# EAGLE design servo (EAGLE 7.5.0)
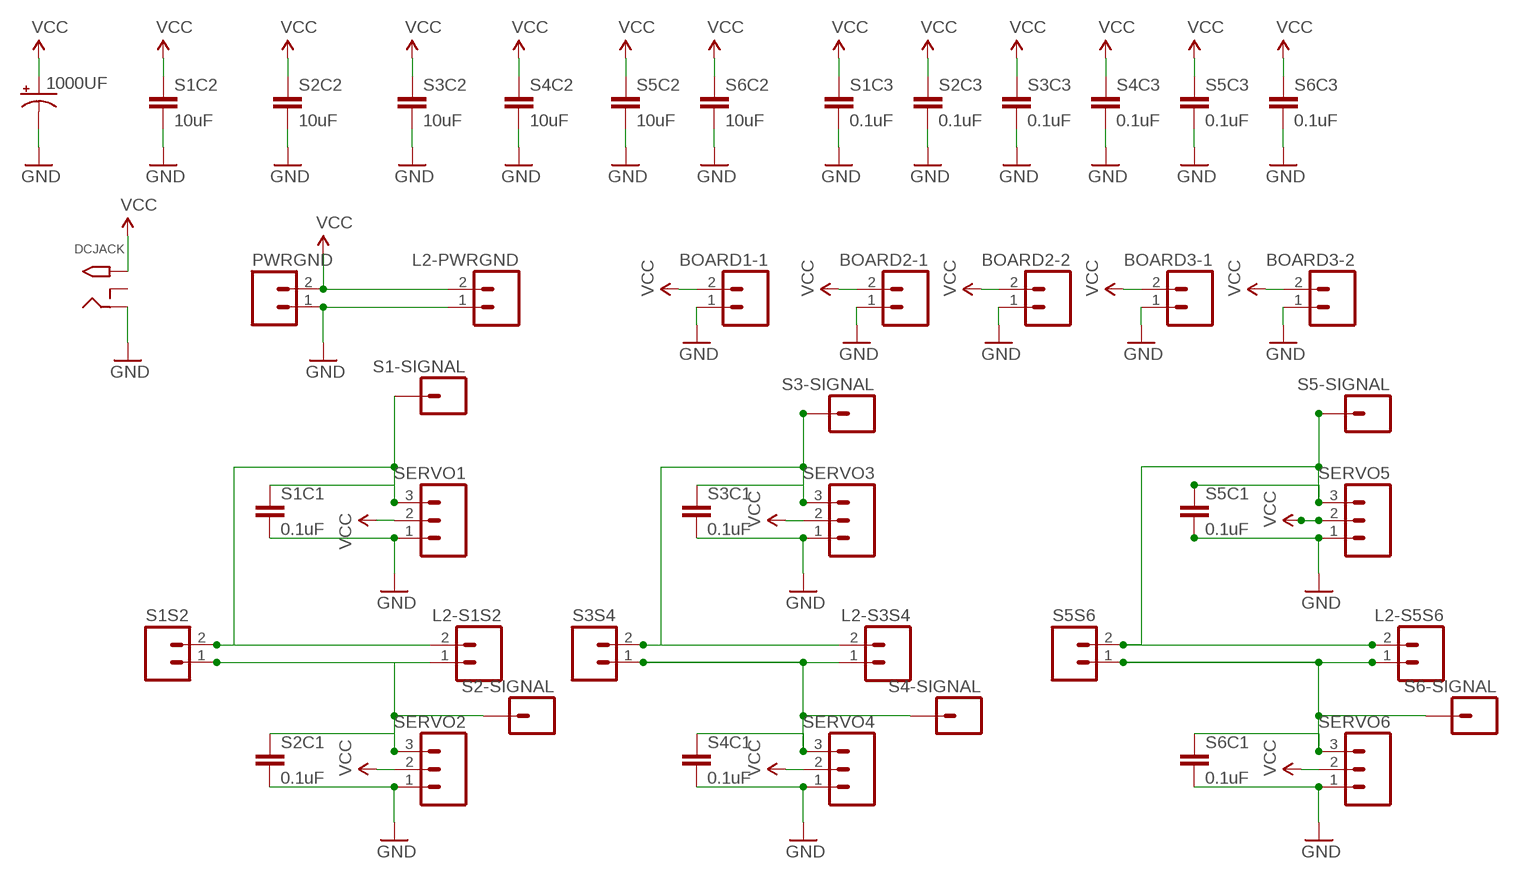
[diagram p0: schematic, sheet 1]

## Parts
1000UF  CAP_POLG  [PANASONIC_G]
BOARD1-1  M02PTH  [1X02]
BOARD2-1  M02PTH  [1X02]
BOARD2-2  M02PTH  [1X02]
BOARD3-1  M02PTH  [1X02]
BOARD3-2  M02PTH  [1X02]
DCJACK  2.1MMJACKTHM  [PJ-102A]
L2-PWRGND  M02PTH  [1X02]
L2-S1S2  M02PTH  [1X02]
L2-S3S4  M02PTH  [1X02]
L2-S5S6  M02PTH  [1X02]
PWRGND  M02PTH  [1X02]
S1-SIGNAL  M01PTH  [1X01]
S1C1  0.1uF  0.1UF-25V-5%(0603)  [0603-CAP]
S1C2  10uF  10UF-6.3V-20%(0603)  [0603-CAP]
S1C3  0.1uF  0.1UF-25V-5%(0603)  [0603-CAP]
S1S2  M02PTH  [1X02]
S2-SIGNAL  M01PTH  [1X01]
S2C1  0.1uF  0.1UF-25V-5%(0603)  [0603-CAP]
S2C2  10uF  10UF-6.3V-20%(0603)  [0603-CAP]
S2C3  0.1uF  0.1UF-25V-5%(0603)  [0603-CAP]
S3-SIGNAL  M01PTH  [1X01]
S3C1  0.1uF  0.1UF-25V-5%(0603)  [0603-CAP]
S3C2  10uF  10UF-6.3V-20%(0603)  [0603-CAP]
S3C3  0.1uF  0.1UF-25V-5%(0603)  [0603-CAP]
S3S4  M02PTH  [1X02]
S4-SIGNAL  M01PTH  [1X01]
S4C1  0.1uF  0.1UF-25V-5%(0603)  [0603-CAP]
S4C2  10uF  10UF-6.3V-20%(0603)  [0603-CAP]
S4C3  0.1uF  0.1UF-25V-5%(0603)  [0603-CAP]
S5-SIGNAL  M01PTH  [1X01]
S5C1  0.1uF  0.1UF-25V-5%(0603)  [0603-CAP]
S5C2  10uF  10UF-6.3V-20%(0603)  [0603-CAP]
S5C3  0.1uF  0.1UF-25V-5%(0603)  [0603-CAP]
S5S6  M02PTH  [1X02]
S6-SIGNAL  M01PTH  [1X01]
S6C1  0.1uF  0.1UF-25V-5%(0603)  [0603-CAP]
S6C2  10uF  10UF-6.3V-20%(0603)  [0603-CAP]
S6C3  0.1uF  0.1UF-25V-5%(0603)  [0603-CAP]
SERVO1  M03PTH  [1X03]
SERVO2  M03PTH  [1X03]
SERVO3  M03PTH  [1X03]
SERVO4  M03PTH  [1X03]
SERVO5  M03PTH  [1X03]
SERVO6  M03PTH  [1X03]

## Nets
GND: 1000UF.- BOARD1-1.1 BOARD2-1.1 BOARD2-2.1 BOARD3-1.1 BOARD3-2.1 DCJACK.RING L2-PWRGND.1 PWRGND.1 S1C1.2 S1C2.2 S1C3.2 S2C1.2 S2C2.2 S2C3.2 S3C1.2 S3C2.2 S3C3.2 S4C1.2 S4C2.2 S4C3.2 S5C1.2 S5C2.2 S5C3.2 S6C1.2 S6C2.2 S6C3.2 SERVO1.1 SERVO2.1 SERVO3.1 SERVO4.1 SERVO5.1 SERVO6.1
N$1: L2-S3S4.2 S3-SIGNAL.1 S3C1.1 S3S4.2 SERVO3.3
N$2: L2-S1S2.2 S1-SIGNAL.1 S1C1.1 S1S2.2 SERVO1.3
N$3: L2-S3S4.1 S3S4.1 S4-SIGNAL.1 S4C1.1 SERVO4.3
N$4: L2-S1S2.1 S1S2.1 S2-SIGNAL.1 S2C1.1 SERVO2.3
N$5: L2-S5S6.2 S5-SIGNAL.1 S5C1.1 S5S6.2 SERVO5.3
N$6: L2-S5S6.1 S5S6.1 S6-SIGNAL.1 S6C1.1 SERVO6.3
VCC: 1000UF.+ BOARD1-1.2 BOARD2-1.2 BOARD2-2.2 BOARD3-1.2 BOARD3-2.2 DCJACK.TIP L2-PWRGND.2 PWRGND.2 S1C2.1 S1C3.1 S2C2.1 S2C3.1 S3C2.1 S3C3.1 S4C2.1 S4C3.1 S5C2.1 S5C3.1 S6C2.1 S6C3.1 SERVO1.2 SERVO2.2 SERVO3.2 SERVO4.2 SERVO5.2 SERVO6.2
Unconnected: DCJACK.RING_SW

## Library data of the parts
1000UF = SparkFun-Capacitors:CAP_POL: Capacitor Polarized These are standard SMD and PTH capacitors. Normally 10uF, 47uF, and 100uF in electrolytic and tantalum varieties. Always verify the external diameter of the through hole cap, it varies with capacity, voltage, and manufacturer. The EIA devices should be standard.
BOARD1-1 BOARD2-1 BOARD2-2 BOARD3-1 BOARD3-2 L2-PWRGND L2-S1S2 L2-S3S4 L2-S5S6 PWRGND S1S2 S3S4 S5S6 = SparkFun-Connectors:M02: Standard 2-pin 0.1" header. Use with - straight break away headers ( PRT-00116) - right angle break away headers (PRT-00553) - swiss pins (PRT-00743) - machine pins (PRT-00117) - female headers (PRT-00115) Molex polarized connector foot print use with: PRT-08233 with associated crimp pins and housings. 2.54_SCREWTERM for use with PRT-10571. 3.5mm Screw Terminal footprints for PRT-08084 5mm Screw Terminal footprints for use with PRT-08432
DCJACK = adafruit:2.1MMJACK: 2.1mm x 5.5mm THM DC jack with internal switch. Digikey part #PJ-102A, 4UCON part #05537 2.1mm x 5.5mm SMT DC jack with internal switch. Digikey part #PJ-002A-SMT, 4UCON part #03267 By microbuilder.eu & adafruit.com
S1-SIGNAL S2-SIGNAL S3-SIGNAL S4-SIGNAL S5-SIGNAL S6-SIGNAL = SparkFun-Connectors:M01: Header 1 Standard 1-pin 0.1" header. Use with straight break away headers (SKU : PRT-00116), right angle break away headers (PRT-00553), swiss pins (PRT-00743), machine pins (PRT-00117), and female headers (PRT-00115). SMTSO-256-ET is a "flush mount" nut for a 4-40 screw. The older package used to be too tight, and did not allow it to sit properly thru the drill hit. The latest (0.165DIA) fits nice and snug.
S1C1 S1C3 S2C1 S2C3 S3C1 S3C3 S4C1 S4C3 S5C1 S5C3 S6C1 S6C3 = SparkFun-Capacitors:0.1UF-25V-5%(0603): CAP-08604; PROD_ID: CAP-08604
S1C2 S2C2 S3C2 S4C2 S5C2 S6C2 = SparkFun-Capacitors:10UF-6.3V-20%(0603): CAP-11015; PROD_ID: CAP-11015
SERVO1-SERVO6 = SparkFun-Connectors:M03: Header 3 Standard 3-pin 0.1" header. Use with straight break away headers (SKU : PRT-00116), right angle break away headers (PRT-00553), swiss pins (PRT-00743), machine pins (PRT-00117), and female headers (PRT-00115). Molex polarized connector foot print use with SKU : PRT-08232 with associated crimp pins and housings.

## Board
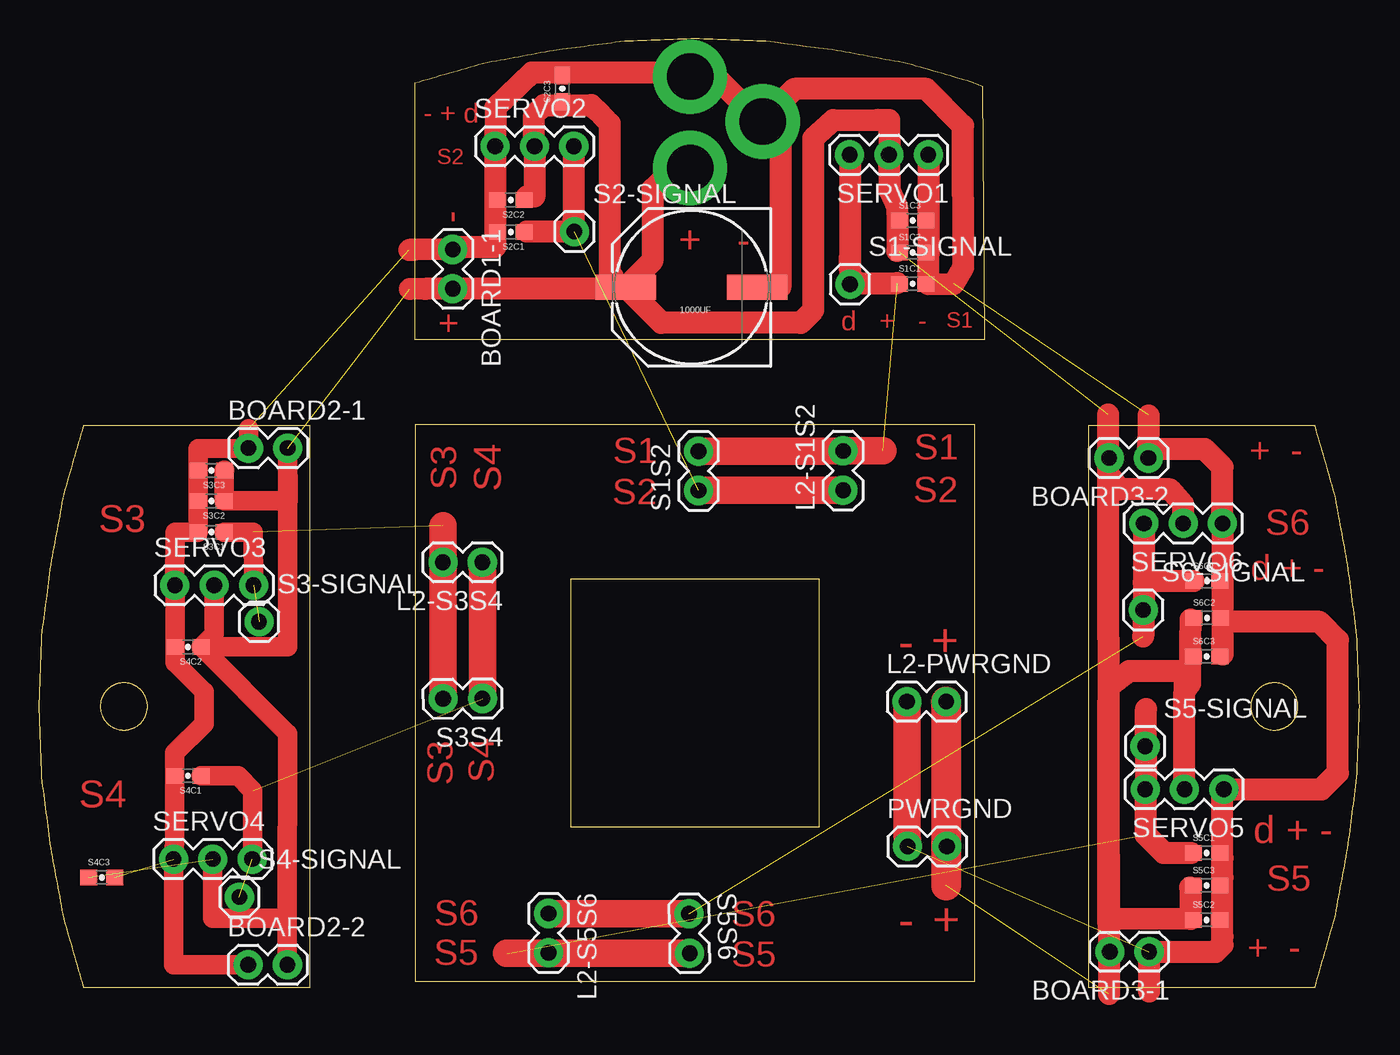
[diagram p1: board, top side]
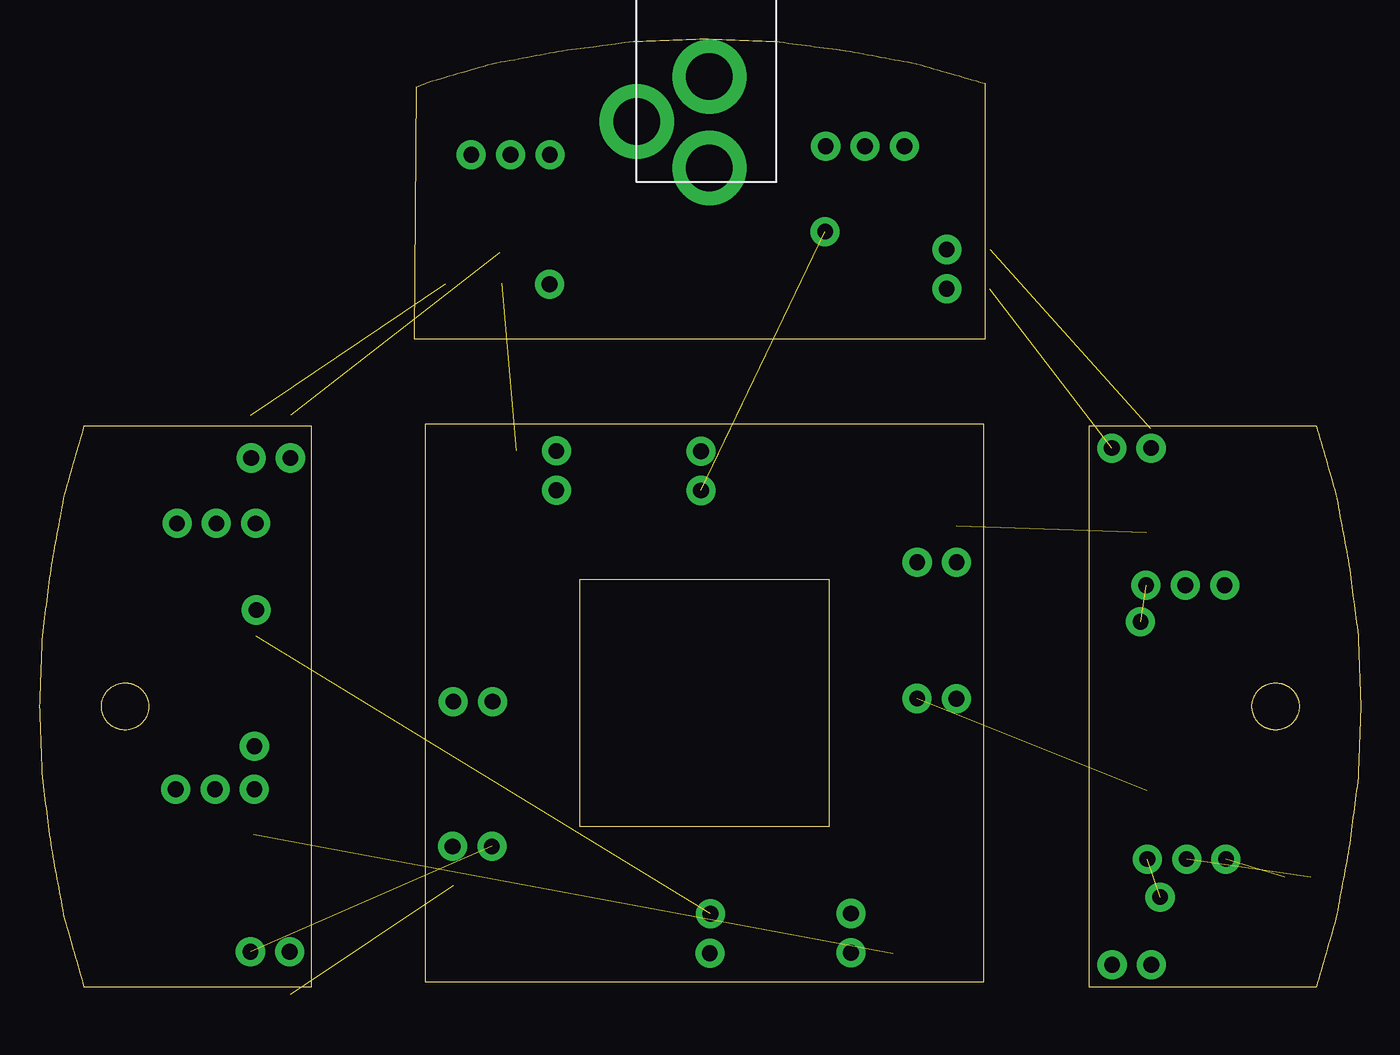
[diagram p2: board, bottom side, seen from below]

Size 85.32 x 61.23 mm. Coordinates in mm from the lower left corner, seen from the top.
Outline: 50.44,10.34 50.44,26.35 34.35,26.35 34.35,10.34 50.44,10.34
Outline: 24.36,0.35 24.36,36.34 60.43,36.34 60.43,0.35 24.36,0.35
Outline: 56.13,59.62 55.84,59.68 55.55,59.73 55.27,59.78 54.98,59.84 54.7,59.89 54.41,59.94 54.13,60 53.84,60.05 53.55,60.1 53.27,60.15 52.98,60.21 52.7,60.26 52.41,60.31 52.12,60.37 51.84,60.42 51.55,60.47 51.27,60.51 50.98,60.55 50.7,60.58 50.41,60.62 50.12,60.66 49.84,60.69 49.55,60.73 48.98,60.8 48.7,60.84 48.41,60.88 48.12,60.92 47.55,60.99 47.27,61.03 46.98,61.06 46.7,61.07 46.41,61.09 46.12,61.1 45.84,61.11 45.55,61.12 45.27,61.13 44.98,61.14 44.7,61.15 44.41,61.16 44.12,61.17 43.84,61.18 43.55,61.19 43.27,61.2 42.98,61.21 42.7,61.22 42.41,61.23 42.12,61.22 41.84,61.21 41.55,61.2 41.27,61.19 40.98,61.18 40.69,61.17 40.41,61.16 40.12,61.15 39.84,61.14 39.55,61.13 39.27,61.12 38.98,61.11 38.69,61.1 38.41,61.09 38.12,61.07 37.84,61.06 37.55,61.03 37.27,60.99 36.98,60.95 36.69,60.92 36.12,60.84 35.84,60.8 35.55,60.77 35.27,60.73 34.98,60.69 34.69,60.66 34.41,60.62 34.12,60.58 33.84,60.55 33.27,60.47 32.98,60.42 32.69,60.37 32.41,60.31 32.12,60.26 31.84,60.21 31.55,60.15 31.27,60.1 30.98,60.05 30.69,60 30.41,59.94 30.12,59.89 29.84,59.84 29.55,59.78 29.26,59.73 28.98,59.68 28.69,59.62 28.42,59.55 28.14,59.47 27.87,59.39 27.59,59.31 27.32,59.23 27.04,59.15 26.77,59.07 26.22,58.91 25.94,58.83 25.67,58.75 25.12,58.59 24.84,58.51 24.57,58.43 24.29,58.35 24.29,41.83 61.11,41.83 61,58.12 60.25,58.43 59.98,58.51 59.7,58.59 59.15,58.75 58.88,58.83 58.6,58.91 58.33,58.99 58.05,59.07 57.78,59.15 57.5,59.23 56.95,59.39 56.68,59.47 56.4,59.55 56.13,59.62
Outline: 3.98,18.17 3.98,18.07 3.98,18.01 3.99,17.96 3.99,17.91 4,17.86 4.02,17.76 4.03,17.71 4.05,17.67 4.06,17.62 4.08,17.57 4.1,17.53 4.12,17.48 4.14,17.44 4.16,17.39 4.19,17.35 4.21,17.31 4.24,17.27 4.27,17.23 4.3,17.19 4.33,17.15 4.36,17.11 4.39,17.08 4.43,17.04 4.46,17.01 4.5,16.97 4.53,16.94 4.57,16.91 4.61,16.88 4.65,16.86 4.69,16.83 4.73,16.8 4.78,16.78 4.82,16.76 4.86,16.73 4.91,16.71 4.96,16.7 5,16.68 5.05,16.66 5.1,16.65 5.15,16.64 5.2,16.63 5.25,16.62 5.3,16.61 5.35,16.6 5.4,16.6 5.45,16.59 5.56,16.59 5.61,16.6 5.66,16.6 5.71,16.61 5.76,16.62 5.81,16.63 5.86,16.64 5.91,16.65 5.96,16.66 6,16.68 6.05,16.7 6.1,16.71 6.14,16.73 6.19,16.76 6.23,16.78 6.27,16.8 6.32,16.83 6.36,16.86 6.4,16.88 6.44,16.91 6.47,16.94 6.51,16.97 6.55,17.01 6.58,17.04 6.62,17.08 6.65,17.11 6.68,17.15 6.71,17.19 6.74,17.23 6.77,17.27 6.79,17.31 6.82,17.35 6.84,17.39 6.87,17.44 6.89,17.48 6.91,17.53 6.93,17.57 6.94,17.62 6.96,17.67 6.97,17.71 6.99,17.76 7.01,17.86 7.01,17.91 7.02,17.96 7.02,18.01 7.03,18.07 7.03,18.17 7.02,18.22 7.01,18.33 7.01,18.38 6.99,18.48 6.97,18.52 6.96,18.57 6.94,18.62 6.93,18.67 6.91,18.71 6.89,18.76 6.87,18.8 6.84,18.85 6.82,18.89 6.79,18.93 6.77,18.97 6.74,19.01 6.71,19.05 6.68,19.09 6.65,19.13 6.62,19.16 6.58,19.2 6.55,19.23 6.51,19.26 6.47,19.29 6.44,19.33 6.4,19.36 6.36,19.38 6.32,19.41 6.27,19.44 6.19,19.48 6.14,19.5 6.1,19.52 6.05,19.54 6,19.56 5.96,19.57 5.91,19.59 5.86,19.6 5.76,19.62 5.71,19.63 5.66,19.63 5.61,19.64 5.56,19.64 5.45,19.64 5.4,19.64 5.35,19.63 5.3,19.63 5.25,19.62 5.15,19.6 5.1,19.59 5.05,19.57 5,19.56 4.96,19.54 4.91,19.52 4.86,19.5 4.82,19.48 4.78,19.46 4.73,19.44 4.69,19.41 4.65,19.38 4.61,19.36 4.57,19.33 4.53,19.29 4.5,19.26 4.46,19.23 4.39,19.16 4.36,19.13 4.33,19.09 4.3,19.05 4.27,19.01 4.24,18.97 4.21,18.93 4.19,18.89 4.16,18.85 4.14,18.8 4.12,18.76 4.1,18.71 4.08,18.67 4.06,18.62 4.05,18.57 4.03,18.52 4.02,18.48 4,18.38 3.99,18.33 3.99,18.28 3.98,18.22 3.98,18.17
Outline: 2.88,36.24 2.8,35.96 2.72,35.69 2.64,35.41 2.56,35.14 2.48,34.86 2.4,34.59 2.32,34.31 2.24,34.04 2.16,33.76 2.09,33.49 2.01,33.21 1.85,32.66 1.77,32.39 1.69,32.11 1.61,31.84 1.56,31.55 1.5,31.26 1.45,30.98 1.4,30.69 1.34,30.41 1.29,30.12 1.24,29.83 1.19,29.55 1.13,29.26 1.08,28.98 1.03,28.69 0.97,28.41 0.92,28.12 0.87,27.83 0.82,27.55 0.76,27.26 0.73,26.98 0.69,26.69 0.65,26.41 0.61,26.12 0.58,25.83 0.54,25.55 0.5,25.26 0.43,24.69 0.39,24.41 0.35,24.12 0.32,23.83 0.28,23.55 0.24,23.26 0.21,22.98 0.17,22.69 0.16,22.41 0.15,22.12 0.14,21.83 0.13,21.55 0.12,21.26 0.11,20.98 0.1,20.69 0.08,20.41 0.07,20.12 0.06,19.83 0.05,19.55 0.04,19.26 0.03,18.98 0.02,18.69 0.01,18.41 0,18.12 0.01,17.83 0.02,17.55 0.03,17.26 0.04,16.98 0.05,16.69 0.06,16.4 0.07,16.12 0.08,15.83 0.1,15.55 0.11,15.26 0.12,14.98 0.13,14.69 0.14,14.4 0.15,14.12 0.16,13.83 0.17,13.55 0.21,13.26 0.24,12.98 0.28,12.69 0.32,12.4 0.35,12.12 0.39,11.83 0.43,11.55 0.47,11.26 0.5,10.98 0.54,10.69 0.58,10.4 0.61,10.12 0.65,9.83 0.69,9.55 0.73,9.26 0.76,8.98 0.82,8.69 0.87,8.4 0.92,8.12 0.97,7.83 1.03,7.55 1.08,7.26 1.13,6.97 1.19,6.69 1.24,6.4 1.29,6.12 1.34,5.83 1.4,5.55 1.45,5.26 1.5,4.97 1.56,4.69 1.61,4.4 1.69,4.13 1.77,3.85 1.85,3.58 2.01,3.03 2.09,2.75 2.16,2.48 2.24,2.2 2.32,1.93 2.4,1.65 2.48,1.38 2.56,1.1 2.64,0.83 2.72,0.55 2.8,0.28 2.88,0 17.53,0 17.53,36.24 2.88,36.24
Outline: 81.34,18.17 81.34,18.22 81.33,18.28 81.33,18.33 81.32,18.38 81.3,18.48 81.29,18.52 81.27,18.57 81.26,18.62 81.24,18.67 81.22,18.71 81.2,18.76 81.18,18.8 81.16,18.85 81.13,18.89 81.11,18.93 81.08,18.97 81.05,19.01 81.02,19.05 80.99,19.09 80.96,19.13 80.93,19.16 80.89,19.2 80.86,19.23 80.82,19.26 80.79,19.29 80.75,19.33 80.71,19.36 80.67,19.38 80.63,19.41 80.59,19.44 80.54,19.46 80.5,19.48 80.45,19.5 80.41,19.52 80.36,19.54 80.32,19.56 80.27,19.57 80.22,19.59 80.17,19.6 80.12,19.61 80.07,19.62 80.02,19.63 79.97,19.64 79.92,19.64 79.87,19.64 79.76,19.64 79.71,19.64 79.66,19.64 79.61,19.63 79.56,19.62 79.46,19.6 79.41,19.59 79.36,19.57 79.32,19.56 79.27,19.54 79.22,19.52 79.18,19.5 79.13,19.48 79.09,19.46 79.05,19.44 79.01,19.41 78.96,19.38 78.92,19.36 78.88,19.33 78.85,19.29 78.81,19.26 78.77,19.23 78.74,19.2 78.7,19.16 78.67,19.13 78.64,19.09 78.61,19.05 78.58,19.01 78.55,18.97 78.52,18.93 78.5,18.89 78.48,18.85 78.45,18.8 78.43,18.76 78.41,18.71 78.39,18.67 78.38,18.62 78.36,18.57 78.35,18.52 78.33,18.48 78.32,18.43 78.31,18.38 78.31,18.33 78.3,18.28 78.3,18.22 78.29,18.17 78.29,18.07 78.3,18.01 78.3,17.96 78.31,17.91 78.31,17.86 78.32,17.81 78.33,17.76 78.35,17.71 78.36,17.67 78.38,17.62 78.39,17.57 78.41,17.53 78.43,17.48 78.45,17.44 78.48,17.39 78.5,17.35 78.52,17.31 78.55,17.27 78.58,17.23 78.61,17.19 78.64,17.15 78.67,17.11 78.7,17.08 78.74,17.04 78.77,17.01 78.81,16.97 78.85,16.94 78.88,16.91 78.92,16.88 78.96,16.86 79.01,16.83 79.05,16.8 79.09,16.78 79.13,16.76 79.18,16.73 79.22,16.71 79.27,16.7 79.32,16.68 79.36,16.66 79.41,16.65 79.46,16.64 79.51,16.63 79.56,16.62 79.61,16.61 79.71,16.6 79.76,16.6 79.87,16.6 79.92,16.6 79.97,16.6 80.02,16.61 80.07,16.62 80.12,16.63 80.17,16.64 80.22,16.65 80.27,16.66 80.32,16.68 80.36,16.7 80.41,16.71 80.45,16.73 80.5,16.76 80.54,16.78 80.59,16.8 80.63,16.83 80.67,16.86 80.71,16.88 80.75,16.91 80.79,16.94 80.82,16.97 80.86,17.01 80.89,17.04 80.93,17.08 80.96,17.11 80.99,17.15 81.02,17.19 81.05,17.23 81.08,17.27 81.11,17.31 81.13,17.35 81.16,17.39 81.18,17.44 81.2,17.48 81.22,17.53 81.24,17.57 81.26,17.62 81.27,17.67 81.29,17.71 81.3,17.76 81.32,17.86 81.33,17.91 81.33,17.96 81.34,18.01 81.34,18.07 81.34,18.17
Outline: 85.15,22.69 85.11,22.98 85.08,23.26 85.04,23.55 85,23.83 84.97,24.12 84.93,24.41 84.89,24.69 84.85,24.98 84.82,25.26 84.78,25.55 84.74,25.83 84.71,26.12 84.67,26.41 84.63,26.69 84.6,26.98 84.56,27.26 84.5,27.55 84.45,27.83 84.4,28.12 84.35,28.41 84.29,28.69 84.24,28.98 84.19,29.26 84.13,29.55 84.08,29.84 84.03,30.12 83.98,30.41 83.87,30.98 83.82,31.26 83.76,31.55 83.71,31.84 83.63,32.11 83.55,32.39 83.47,32.66 83.39,32.94 83.23,33.49 83.16,33.76 83.08,34.04 83,34.31 82.84,34.86 82.76,35.14 82.68,35.41 82.6,35.69 82.52,35.96 82.44,36.24 67.79,36.24 67.79,0 82.44,0 82.52,0.28 82.6,0.55 82.68,0.83 82.92,1.65 83,1.93 83.08,2.2 83.16,2.48 83.23,2.75 83.47,3.58 83.55,3.85 83.63,4.13 83.71,4.4 83.76,4.69 83.82,4.97 83.87,5.26 83.92,5.55 83.98,5.83 84.03,6.12 84.08,6.4 84.13,6.69 84.19,6.97 84.24,7.26 84.29,7.55 84.35,7.83 84.4,8.12 84.45,8.4 84.5,8.69 84.56,8.98 84.6,9.26 84.63,9.55 84.67,9.83 84.71,10.12 84.74,10.4 84.78,10.69 84.82,10.98 84.85,11.26 84.89,11.55 84.93,11.83 84.97,12.12 85,12.4 85.04,12.69 85.08,12.98 85.11,13.26 85.15,13.55 85.16,13.83 85.17,14.12 85.18,14.4 85.19,14.69 85.2,14.98 85.21,15.26 85.22,15.55 85.24,15.83 85.25,16.12 85.26,16.4 85.27,16.69 85.28,16.98 85.29,17.26 85.3,17.55 85.31,17.83 85.32,18.12 85.31,18.41 85.3,18.69 85.29,18.98 85.28,19.26 85.27,19.55 85.26,19.83 85.25,20.12 85.24,20.41 85.22,20.69 85.21,20.98 85.2,21.26 85.19,21.55 85.18,21.83 85.17,22.12 85.16,22.41 85.15,22.69
Copper layers (1*16): Top 0.035mm / dielectric 1.5mm / Bottom 0.035mm
Design rules "default": minimum track width 10mil, minimum drill 24mil, track to track 8mil, track to pad 8mil, pad to pad 8mil, via to via 8mil, smd to smd 8mil, copper to edge 40mil, drill to drill 8mil, minimum pad ring 10mil, minimum via ring 8mil, stop-mask expansion 4mil, vias tented up to drill 0mil, thermal gap 10mil

### Footprints (pad centres in the part's own frame; a part is rotated, then mirrored left to right if it is on the bottom)
PANASONIC_G = smd 3.9 x 1.6: + 4.25,0; - -4.25,0
1X02 = drill 1.016 pad 1.88: 1 0,0; 2 2.54,0
PJ-102A = drill 3 pad 4.8: RING 0.1,-3.39; RING_SW -4.6,-6.29; TIP 0.1,-9.29
1X01 = drill 1.016 pad 1.88: 1 0,0
0603-CAP = smd 1.1 x 1: 1 -0.85,0; 2 0.85,0
1X03 = drill 1.016 pad 1.88: 1 0,0; 2 2.54,0; 3 5.08,0

### Placement (x,y rotation side)
1000UF  42.17,45.18 180 top
BOARD1-1  26.74,47.63 270 top
BOARD2-1  13.55,34.8 0 top
BOARD2-2  13.52,1.44 0 top
BOARD3-1  71.72,2.28 180 top
BOARD3-2  71.68,34.16 180 top
DCJACK  42.17,62.17 0 bottom
L2-PWRGND  56.08,18.43 0 top
L2-S1S2  51.96,32.08 90 top
L2-S3S4  28.65,27.43 180 top
L2-S5S6  32.93,4.75 270 top
PWRGND  56.12,9.08 0 top
S1-SIGNAL  52.4,45.38 0 top
S1C1  56.45,45.41 0 top
S1C2  56.45,47.44 0 top
S1C3  56.45,49.49 0 top
S1S2  42.62,32.06 90 top
S2-SIGNAL  34.6,48.78 0 top
S2C1  30.5,48.76 180 top
S2C2  30.49,50.82 180 top
S2C3  33.82,58.01 90 top
S3-SIGNAL  14.23,23.59 0 top
S3C1  11.14,29.38 180 top
S3C2  11.14,31.39 180 top
S3C3  11.15,33.36 180 top
S3S4  28.66,18.63 180.5 top
S4-SIGNAL  12.96,5.81 0 top
S4C1  9.64,13.64 180 top
S4C2  9.65,21.97 180 top
S4C3  4.07,7.08 0 top
S5-SIGNAL  71.46,15.55 0 top
S5C1  75.43,8.66 0 top
S5C2  75.42,4.34 0 top
S5C3  75.43,6.56 0 top
S5S6  42.01,4.73 270.9 top
S6-SIGNAL  71.34,24.35 0 top
S6C1  75.45,26.21 0 top
S6C2  75.46,23.84 0 top
S6C3  75.44,21.35 0 top
SERVO1  57.46,53.73 180 top
SERVO2  29.48,54.29 0 top
SERVO3  8.79,25.94 0 top
SERVO4  8.71,8.26 0 top
SERVO5  76.55,12.77 180 top
SERVO6  76.46,29.94 180 top

### Tracks (layer width: path | path; a pad name or v marks a point on that pad's centre or on a via)
GND  (4 unrouted)
  Top 0.61: S2C1.2 29.66,49.16 | 29.66,49.16 29.49,47.87 | S1C3.2 57.46,50.26 | S1C2.2 57.47,48.99 | 57.45,45.84 S1C1.2 | S2C3.2 34.75,59.05 | 29.66,49.16 29.64,49.17 S2C2.2
  Top 0.813: 29.49,47.87 29.49,47.79 | S5C1.2 76.28,8.52 76.45,8.35 | S5C3.2 76.28,6.91 76.45,7.08 | S5C2.2 76.27,3.45 76.45,3.27
  Top 1.016: 76.82,23.55 76.6,23.55 S6C2.2 | S6C3.2 76.29,22.21 76.45,22.37 | 76.46,21.46 76.46,23.69 S6C2.2 | S6C2.2 S6C1.2
  Top 1.27: 47.91,45.18 1000UF.- | S3C2.2 10.29,34.75 BOARD2-1.1 13.55,36.03 13.56,36.04 | S3C2.2 10.3,31.18 S3C1.2 8.81,29.38 SERVO3.1 8.8,25.64 S4C2.2 8.8,20.94 10.67,19.07 10.67,17.02 8.79,15.13 8.79,13.65 S4C1.2 | BOARD2-2.1 8.71,1.44 SERVO4.1 8.79,9.48 S4C1.2 | S4C1.2 | 29.49,54.74 SERVO2.1 29.49,54.72 | S3C3.2 S3C2.2
  Top 1.422: SERVO2.1 29.5,56.79 31.86,59.04 34.75,59.05 41.8,59.05 DCJACK.RING 43.72,58.78 46.66,55.84 | 46.66,55.84 47.9,54.6 47.9,45.19 47.91,45.18 | 57.45,45.84 57.45,45.39 | 57.45,45.39 59.11,45.41 59.72,46.46 59.71,55.62 57.35,57.99 48.81,57.99 46.66,55.84 | 29.49,54.72 29.49,47.87 | 71.7,36.92 BOARD3-2.1 71.88,34.74 75.31,34.74 76.46,33.59 SERVO6.1 76.46,21.46 76.45,22.37 | 71.7,0.01 71.71,-0.28 BOARD3-1.1 76.01,2.28 76.45,2.72 76.45,3.27 76.45,7.08 76.45,8.35 76.45,12.68 SERVO5.1 82.85,12.77 83.91,13.83 83.91,22.4 82.73,23.58 76.85,23.58 76.82,23.55 | 24.33,47.62 23.94,47.6 BOARD1-1.1 26.91,47.79 29.49,47.79 | SERVO1.1 57.46,50.26 57.47,48.99 57.45,45.39
  Top 1.778: L2-PWRGND.1 56.08,10.3 PWRGND.1
N$1  (2 unrouted)
  Top 1.27: S3C1.1 13.85,29.38 SERVO3.3
  Top 1.676: L2-S3S4.2 26.16,21.19 S3S4.2
  Top 1.778: S3S4.2 26.13,29.79
N$2  (1 unrouted)
  Top 0.61: 55.45,45.45 55.36,45.8 S1C1.1
  Top 1.27: 53.05,45.45 S1-SIGNAL.1
  Top 1.422: 52.38,47.07 S1-SIGNAL.1 52.4,53.73 | 53.05,45.45 55.45,45.45
  Top 1.676: 54.54,34.62 54.54,34.61 | SERVO1.3 52.4,53.73
  Top 1.778: S1S2.2 50.62,34.6 L2-S1S2.2 54.54,34.62
N$3  (2 unrouted)
  Top 1.27: S4C1.1 12.87,13.64 13.83,12.69 13.83,9.39 SERVO4.3
  Top 1.778: S3S4.1 28.66,26.43 L2-S3S4.1
N$4  (1 unrouted)
  Top 0.813: 31.53,48.78 31.26,48.7 S2C1.1
  Top 1.422: SERVO2.3 34.56,49.54 S2-SIGNAL.1 | 34.52,49.5 S2-SIGNAL.1 | S2-SIGNAL.1 31.56,48.78 31.53,48.78
  Top 1.676: 42.62,32.08 S1S2.1
  Top 1.778: 42.62,32.08 L2-S1S2.1
N$5  (1 unrouted)
  Top 0.61: 74.42,8.67 74.77,8.66 S5C1.1
  Top 1.422: 71.5,12.81 71.5,9.83 72.66,8.67 73.45,8.67 74.42,8.67 | 71.5,15.51 S5-SIGNAL.1 | 71.5,15.51 71.52,17.94 | 71.5,15.51 71.5,12.81 | 71.5,12.81 SERVO5.3
  Top 1.676: L2-S5S6.2 39.46,2.21 S5S6.2 | 30.21,2.19 30.21,2.14
  Top 1.778: S5S6.2 30.21,2.19
N$6  (1 unrouted)
  Top 1.422: SERVO6.3 71.38,26.13 | 71.38,26.13 71.38,24.39 S6-SIGNAL.1 71.34,22.64 | S6C1.1 71.45,26.2 71.38,26.13
  Top 1.778: L2-S5S6.1 39.42,4.75 S5S6.1
VCC  (4 unrouted)
  Top 0.61: 74.4,23.72 S6C2.1 | S6C3.1 74.39,22.33 | S2C3.1 36.13,56.56
  Top 0.813: 74.39,4.39 74.52,4.39 S5C2.1 | S5C3.1 74.38,6.42 | 55.45,50.31 S1C3.1 55.45,50.02 | 31.52,51.03 S2C2.1
  Top 1.016: 74.38,4.57 S5C2.1 | 55.45,47.53 S1C2.1
  Top 1.27: S4C2.1 16.09,16.36 16.06,4.46 16.06,4.43 | 16.06,4.43 11.25,4.46 SERVO4.2 | BOARD2-2.2 16.06,4.43 | SERVO3.2 11.35,22.81 S4C2.1 | S4C2.1 16.09,21.97 BOARD2-1.2 16.11,31.39 S3C2.1 S3C3.1
  Top 1.422: DCJACK.TIP 40.98,52.88 39.63,51.53 39.63,46.89 1000UF.+ | 1000UF.+ 40.22,42.88 49.22,42.88 50.04,43.71 50.04,54.8 51.33,55.98 54.16,55.99 54.93,55.97 54.94,53.8 SERVO1.2 54.94,51.45 55.45,50.31 | 1000UF.+ 37.09,45.18 | 23.96,45.07 24.98,45.09 BOARD1-1.2 37,45.09 37.09,45.18 | 69.1,33.14 69.1,22.44 69.09,17.69 | 69.1,33.14 69.1,34.52 | 69.1,34.52 BOARD3-2.2 | SERVO6.2 73.92,31.18 73.09,32.13 69.83,32.13 69.1,33.14 | SERVO5.2 74.01,19.06 | 74.01,19.06 74.38,19.61 74.39,22.33 74.4,23.72 | BOARD3-1.2 69.09,4.41 | 69.09,4.41 69.09,17.69 | 69.09,17.69 69.12,19.41 70.43,20.41 73.99,20.41 74.01,19.06 | 74.39,4.39 69.09,4.41 | 74.38,6.42 74.38,4.57 | 55.45,50.02 55.45,47.53 | 37.09,45.18 37.09,45.87 36.88,46.08 36.88,55.75 36.13,56.56 35.68,56.95 32.63,56.95 32.01,56.33 32.01,54.74 32.02,54.73 SERVO2.2 32.02,51.04 31.52,51.03 | 69.1,34.52 69.08,36.96 | 69.09,17.69 69.13,-0.46
  Top 1.676: PWRGND.2 58.59,15.48 | L2-PWRGND.2
  Top 1.778: 58.59,15.48 L2-PWRGND.2
  Top 1.93: L2-PWRGND.2 58.61,6.56

### Text on the board
Top: - + d | S2 | - | + | - | S1 | + | d + - | + - | S1 | S1 | S3 | S4 | S2 | S2 | S3 | S6 | d + - | - | + | S3 | S4 | S4 | d + - | S6 | S6 | S5 | S5 | S5 | - | + | + -